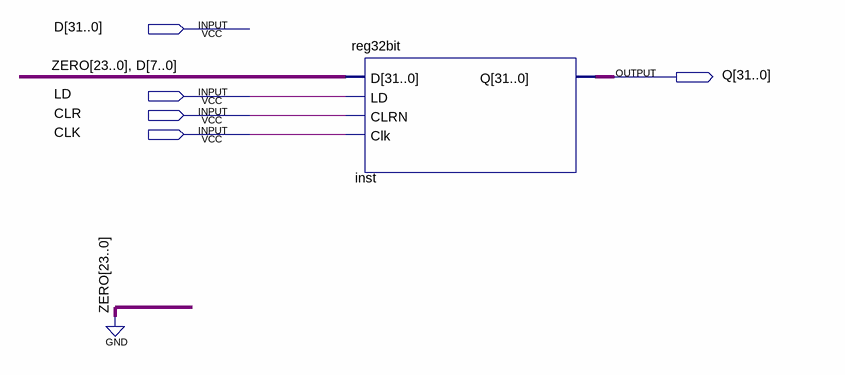
[diagram p0: schematic sheet]
// Quartus schematic reg32bit_upper8_unsigned.bdf as structural Verilog: 1 symbols, 5 pins
module reg32bit_upper8_unsigned (
  input  [31:0] D,
  input  LD,
  input  CLR,
  input  CLK,
  output [31:0] Q
);

  reg32bit inst (.D({{24{1'b0}}, D[7:0]}), .LD(LD), .CLRN(CLR), .Clk(CLK), .Q(Q));
endmodule
